# EAGLE schematic h7-disco (EAGLE 7.7.0)
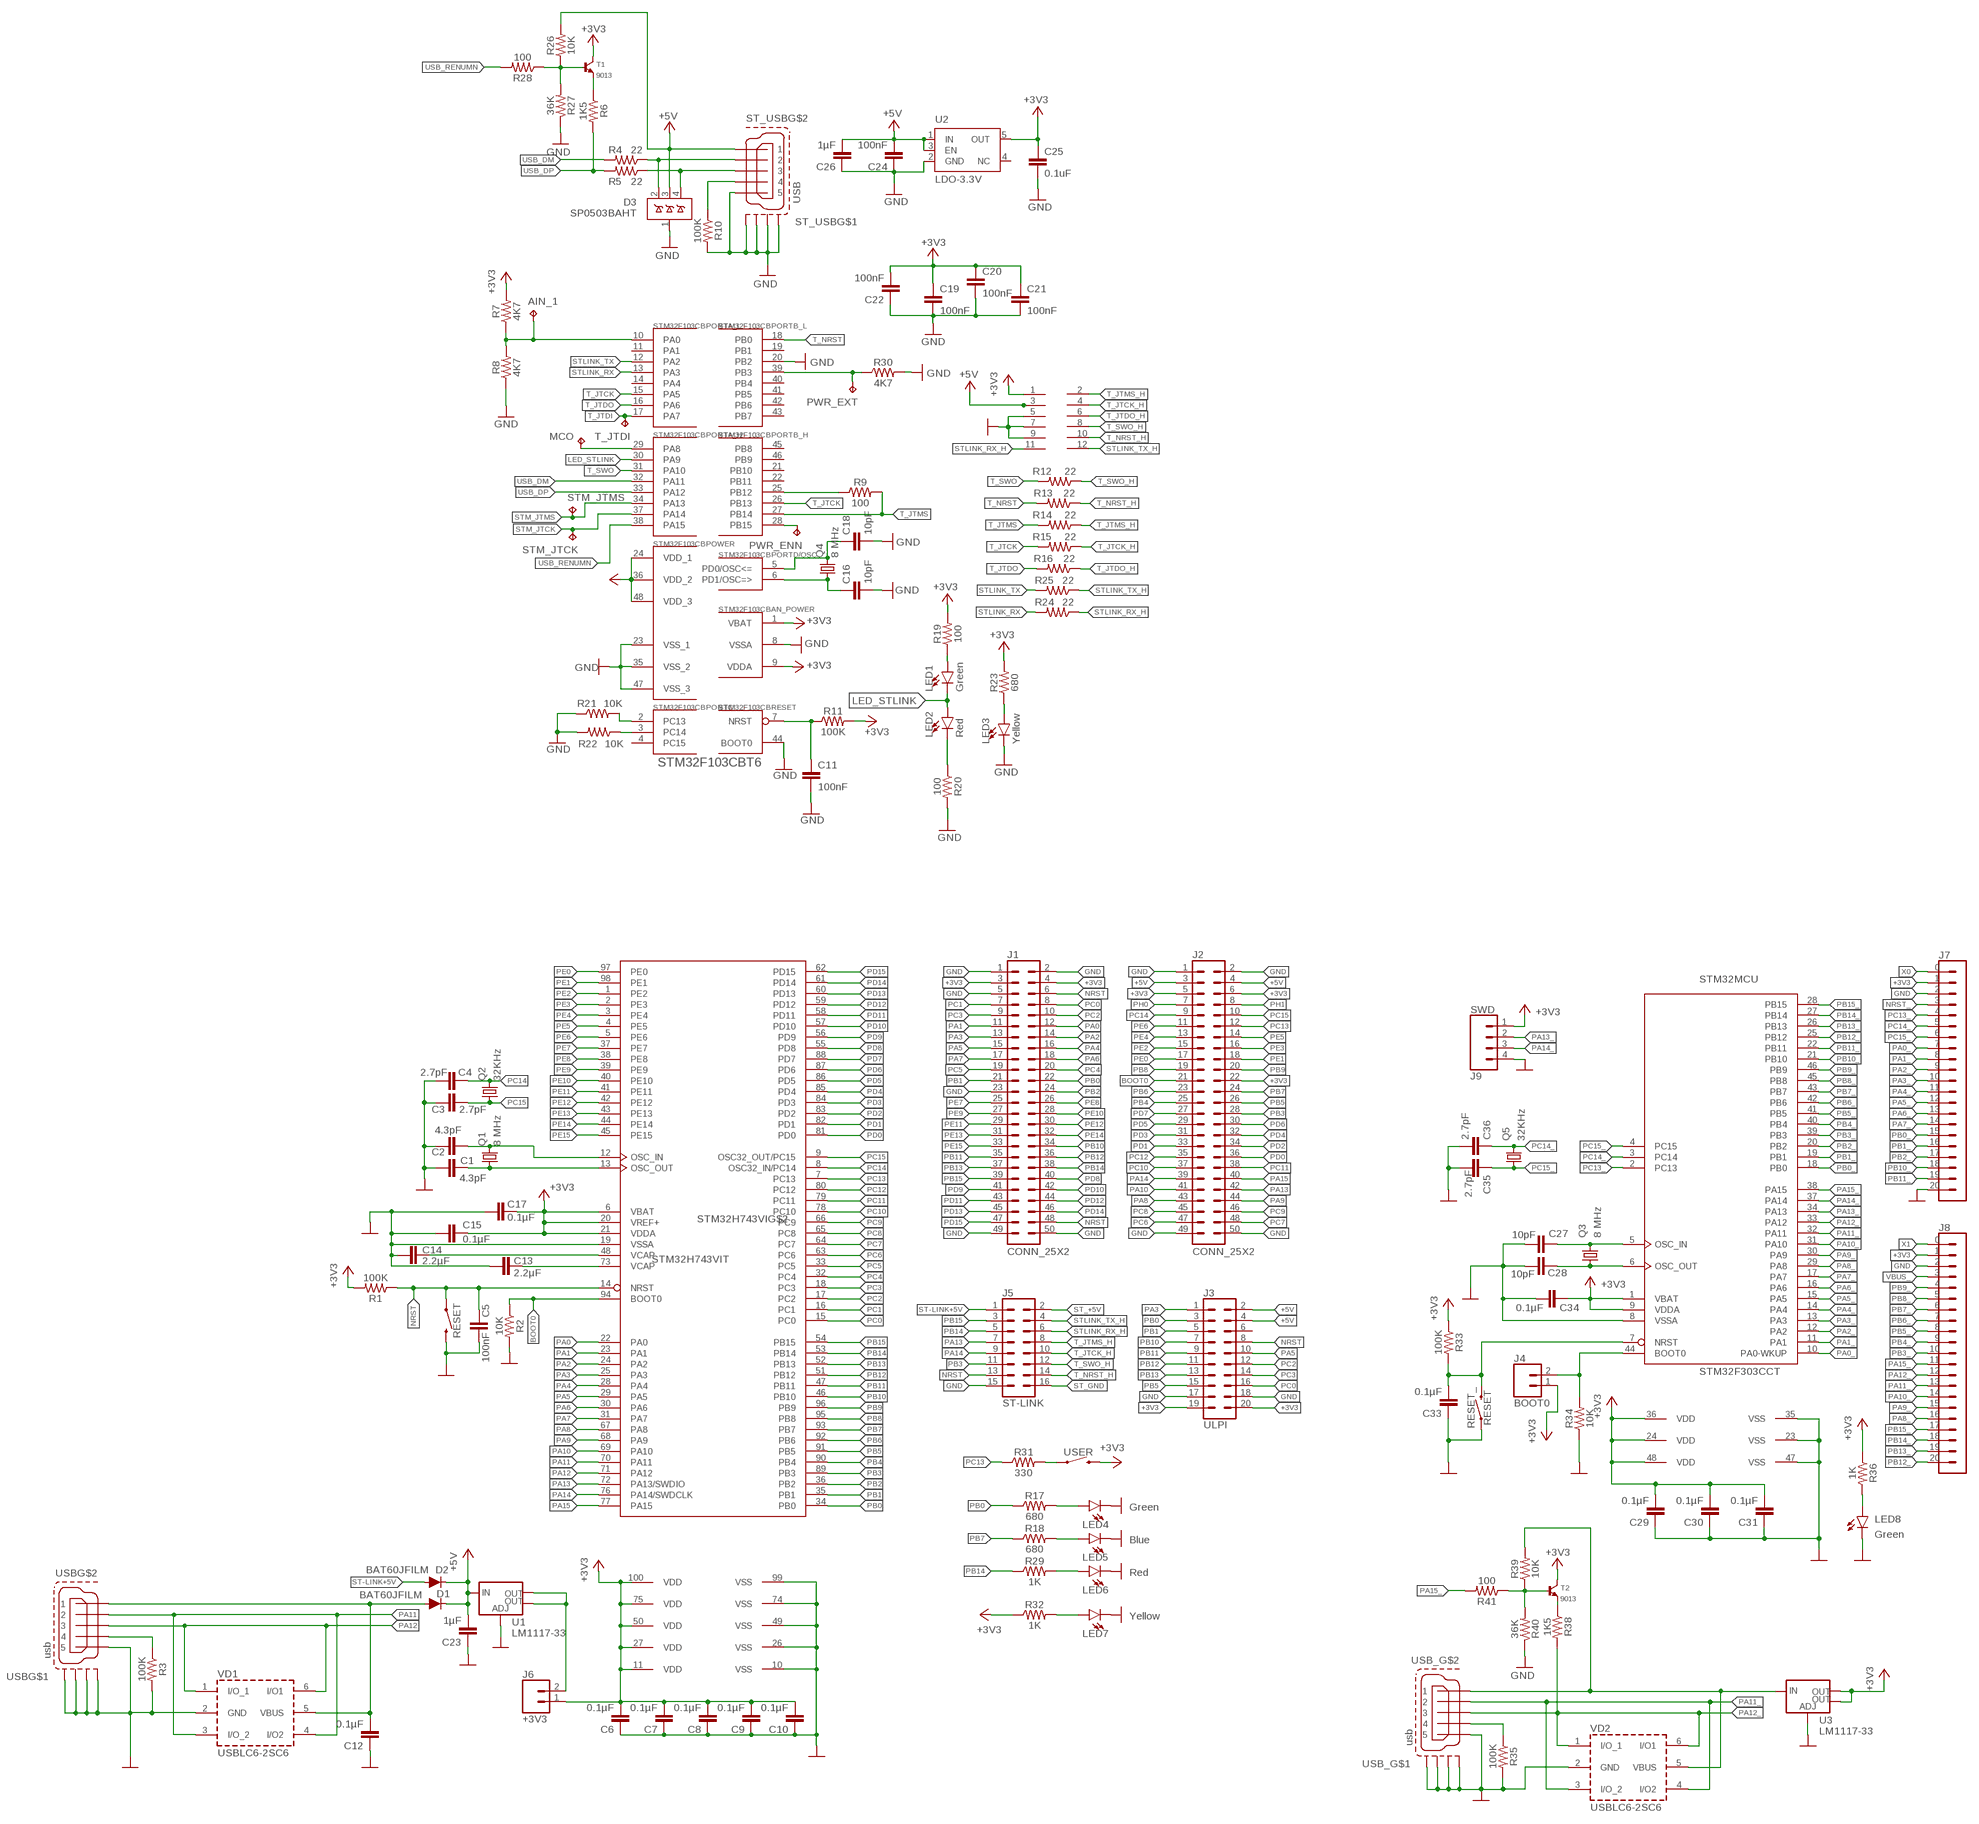
[diagram p0: schematic, sheet 1]

## Parts
AIN_1  TPTP10R  [TP10R]
C1  4.3pF  0.33UF/330NF-0805-50V-10%  [0805]
C2  4.3pF  0.33UF/330NF-0805-50V-10%  [0805]
C3  2.7pF  0.33UF/330NF-0805-50V-10%  [0805]
C4  2.7pF  0.33UF/330NF-0805-50V-10%  [0805]
C5  100nF  0.33UF/330NF-0805-50V-10%  [0805]
C6  0.1µF  0.33UF/330NF-0805-50V-10%  [0805]
C7  0.1µF  0.33UF/330NF-0805-50V-10%  [0805]
C8  0.1µF  0.33UF/330NF-0805-50V-10%  [0805]
C9  0.1µF  0.33UF/330NF-0805-50V-10%  [0805]
C10  0.1µF  0.33UF/330NF-0805-50V-10%  [0805]
C11  100nF  2.2UF-0805-25V-(+80/-20%)  [0805]
C12  0.1µF  0.33UF/330NF-0805-50V-10%  [0805]
C13  2.2µF  0.33UF/330NF-0805-50V-10%  [0805]
C14  2.2µF  0.33UF/330NF-0805-50V-10%  [0805]
C15  0.1µF  0.33UF/330NF-0805-50V-10%  [0805]
C16  10pF  2.2UF-0805-25V-(+80/-20%)  [0805]
C17  0.1µF  0.33UF/330NF-0805-50V-10%  [0805]
C18  10pF  2.2UF-0805-25V-(+80/-20%)  [0805]
C19  100nF  2.2UF-0805-25V-(+80/-20%)  [0805]
C20  100nF  2.2UF-0805-25V-(+80/-20%)  [0805]
C21  100nF  2.2UF-0805-25V-(+80/-20%)  [0805]
C22  100nF  2.2UF-0805-25V-(+80/-20%)  [0805]
C23  1µF  2.2UF-1206-50V-10%  [1206]
C24  100nF  0.33UF/330NF-0805-50V-10%  [0805]
C25  0.1uF  2.2UF-0805-25V-(+80/-20%)  [0805]
C26  1µF  2.2UF-1206-50V-10%  [1206]
C27  10pF  0.33UF/330NF-0805-50V-10%  [0805]
C28  10pF  0.33UF/330NF-0805-50V-10%  [0805]
C29  0.1µF  0.33UF/330NF-0805-50V-10%  [0805]
C30  0.1µF  0.33UF/330NF-0805-50V-10%  [0805]
C31  0.1µF  0.33UF/330NF-0805-50V-10%  [0805]
C33  0.1µF  0.33UF/330NF-0805-50V-10%  [0805]
C34  0.1µF  0.33UF/330NF-0805-50V-10%  [0805]
C35  2.7pF  0.33UF/330NF-0805-50V-10%  [0805]
C36  2.7pF  0.33UF/330NF-0805-50V-10%  [0805]
CN2  M06X2  [PLANAR-6X2]
D1  BAT60JFILM  DIODE-BAS16J  [SOD-323]
D2  BAT60JFILM  DIODE-BAS16J  [SOD-323]
D3  SP0503BAHT  [SOT143]
J1  CONN_25X2  [2X25]
J2  CONN_25X2  [2X25]
J3  ULPI  CONN_10X2MIRR  [2X10-MIRROR]
J4  BOOT0  CONN_02  [1X02]
J5  ST-LINK  CONN_08X2  [2X8]
J6  +3V3  CONN_02  [1X02]
J7  CONN_21  [1X21]
J8  CONN_21  [1X21]
J9  SWD  CONN_04  [1X04]
LED1  Green  LED  [LED-0805]
LED2  Red  LED  [LED-0805]
LED3  Yellow  LED  [LED-0805]
LED4  Green  LED  [LED-0805]
LED5  Blue  LED  [LED-0805]
LED6  Red  LED  [LED-0805]
LED7  Yellow  LED  [LED-0805]
LED8  Green  LED  [LED-0805]
MCO  TPTP10R  [TP10R]
PWR_ENN  TPTP10R  [TP10R]
PWR_EXT  TPTP10R  [TP10R]
Q1  8 MHz  CRYSTALHC49S  [HC49/S]
Q2  32KHz  CRYSTALTC26H  [TC26H]
Q3  8 MHz  CRYSTALHC49S  [HC49/S]
Q4  8 MHz  CRYSTALHC49S  [HC49/S]
Q5  32KHz  CRYSTALTC26H  [TC26H]
R1  100K  RESISTOR0805  [0805]
R2  10K  RESISTOR0805  [0805]
R3  100K  RESISTOR0805  [0805]
R4  22  RESISTOR0805  [0805]
R5  22  RESISTOR0805  [0805]
R6  1K5  RESISTOR0805  [0805]
R7  4K7  RESISTOR0805  [0805]
R8  4K7  RESISTOR0805  [0805]
R9  100  RESISTOR0805  [0805]
R10  100K  RESISTOR0805  [0805]
R11  100K  RESISTOR0805  [0805]
R12  22  RESISTOR0805  [0805]
R13  22  RESISTOR0805  [0805]
R14  22  RESISTOR0805  [0805]
R15  22  RESISTOR0805  [0805]
R16  22  RESISTOR0805  [0805]
R17  680  RESISTOR0805  [0805]
R18  680  RESISTOR0805  [0805]
R19  100  RESISTOR0805  [0805]
R20  100  RESISTOR0805  [0805]
R21  10K  RESISTOR0805  [0805]
R22  10K  RESISTOR0805  [0805]
R23  680  RESISTOR0805  [0805]
R24  22  RESISTOR0805  [0805]
R25  22  RESISTOR0805  [0805]
R26  10K  RESISTOR0805  [0805]
R27  36K  RESISTOR0805  [0805]
R28  100  RESISTOR0805  [0805]
R29  1K  RESISTOR0805  [0805]
R30  4K7  RESISTOR0805  [0805]
R31  330  RESISTOR0805  [0805]
R32  1K  RESISTOR0805  [0805]
R33  100K  RESISTOR0805  [0805]
R34  10K  RESISTOR0805  [0805]
R35  100K  RESISTOR0805  [0805]
R36  1K  RESISTOR0805  [0805]
R38  1K5  RESISTOR0805  [0805]
R39  10K  RESISTOR0805  [0805]
R40  36K  RESISTOR0805  [0805]
R41  100  RESISTOR0805  [0805]
RESET  MOMENTARY-SWITCH-SPST-SMD-6.2MM-TALL  [TACTILE_SWITCH_SMD_6.2MM_TALL]
RESET_  RESET  MOMENTARY-SWITCH-SPST-SMD-6.0X3.5MM  [TACTILE_SWITCH_SMD_6.0X3.5MM]
ST_USB  USB  MICRO-USB-SHIELD-MICRO_USB-B_4.85_HORN  [MICRO_USB-B_4.85_HORN]
STM32  STM32F303CCT  [LQFP48]
STM32F103CB  STM32F103CBT6  STM32F10XCXT6  [TQFP48]
STM32H743VI  STM32H743VIT  [LQFP100]
STM_JTCK  TPTP10R  [TP10R]
STM_JTMS  TPTP10R  [TP10R]
T1  9013  NPNBC847  [SOT-23]
T2  9013  NPNBC847  [SOT-23]
T_JTDI  TPTP10R  [TP10R]
U1  LM1117-33  V_REG_LM1117SOT223  [SOT223]
U2  LDO-3.3V  TPS73033  [SOT23-5]
U3  LM1117-33  V_REG_LM1117SOT223  [SOT223]
USB  usb  MICRO-USB-SHIELD-MICRO_USB-B_4.85_HORN  [MICRO_USB-B_4.85_HORN]
USB_  usb  MICRO-USB-SHIELD-MICRO_USB-B_4.85_HORN  [MICRO_USB-B_4.85_HORN]
USER  MOMENTARY-SWITCH-SPST-SMD-6.2MM-TALL  [TACTILE_SWITCH_SMD_6.2MM_TALL]
VD1  USBLC6-2SC6  [SOT-23-6L]
VD2  USBLC6-2SC6  [SOT-23-6L]

## Nets
+3V3: C6.2 C7.2 C8.2 C9.2 C10.2 C15.1 C17.1 C29.2 C30.2 C31.2 C34.1 J1.3 J1.4 J2.5 J2.6 J2.22 J3.19 J3.20 J4.1 J6.1 J7.1 J8.1 J9.1 R1.2 R32.1 R33.1 R36.1 STM32.1(MCU:VBAT) STM32.9(MCU:VDDA) STM32.24(PWR:VDD) STM32.36(PWR:VDD) STM32.48(PWR:VDD) STM32H743VI.6(VBAT) STM32H743VI.11(VDD) STM32H743VI.20(VREF+) STM32H743VI.21(VDDA) STM32H743VI.27(VDD) STM32H743VI.50(VDD) STM32H743VI.75(VDD) STM32H743VI.100(VDD) T2.3(C) U3.2(OUT) U3.4(OUT) USER.B2
+5V: C23.2 D1.C D2.C J2.3 J2.4 J3.2 J3.4 U1.3(IN)
AIN_1: AIN_1.TP R7.1 R8.2 STM32F103CB.10(PORTA_L:PA0)
BOOT0: J2.21 R2.1 STM32H743VI.94(BOOT0)
BOOT0_: J4.2 R34.2 STM32.44(MCU:BOOT0)
D+1: D3.4(D3) R5.1 ST_USB.3
D-1: D3.2(D1) R4.1 ST_USB.2
GND: C1.1 C2.1 C3.1 C4.1 C5.1 C6.1 C7.1 C8.1 C9.1 C10.1 C12.1 C13.2 C14.2 C15.2 C17.2 C23.1 C27.1 C28.2 C29.1 C30.1 C31.1 C33.1 C34.2 C35.1 C36.1 J1.1 J1.2 J1.5 J1.23 J1.49 J1.50 J2.1 J2.2 J2.49 J2.50 J3.17 J3.18 J5.15 J7.2 J7.20 J8.2 J9.4 LED4.C LED5.C LED6.C LED7.C LED8.C R2.2 R3.2 R34.1 R35.2 R40.1 RESET.B2 RESET_.1 STM32.8(MCU:VSSA) STM32.23(PWR:VSS) STM32.35(PWR:VSS) STM32.47(PWR:VSS) STM32H743VI.10(VSS) STM32H743VI.19(VSSA) STM32H743VI.26(VSS) STM32H743VI.49(VSS) STM32H743VI.74(VSS) STM32H743VI.99(VSS) U1.1(ADJ) U3.1(ADJ) USB.5 USB.M1(S1) USB.M2(S2) USB.M3(S3) USB.M4(S4) USB_.5 USB_.M1(S1) USB_.M2(S2) USB_.M3(S3) USB_.M4(S4) VD1.2(GND) VD2.2(GND)
ID: R3.1 USB.4
ID_: R35.1 USB_.4
LED_STLINK: LED1.C LED2.A STM32F103CB.30(PORTA_H:PA9)
MCO: MCO.TP STM32F103CB.29(PORTA_H:PA8)
N$1: C1.2 Q1.1 STM32H743VI.13(OSC_OUT)
N$2: C2.2 Q1.2 STM32H743VI.12(OSC_IN)
N$3: C11.1 R11.1 STM32F103CB.7(RESET:NRST)
N$4: C18.1 Q4.2 STM32F103CB.5(PORTD/OSC:PD0/OSC<=)
N$5: C16.1 Q4.1 STM32F103CB.6(PORTD/OSC:PD1/OSC=>)
N$6: R26.1 R27.2 R28.1 T1.1(B)
N$7: LED2.C R20.1
N$8: LED1.A R19.1
N$10: LED5.A R18.2
N$11: J6.2 U1.2(OUT) U1.4(OUT)
N$12: LED3.A R23.1
N$13: R6.1 T1.2(E)
N$14: LED4.A R17.2
N$15: R21.2 STM32F103CB.2(PORTC:PC13)
N$16: R22.1 STM32F103CB.3(PORTC:PC14)
N$17: LED7.A R32.2
N$19: R10.1 ST_USB.4
N$20: R38.1 T2.2(E)
N$21: R39.1 R40.2 R41.1 T2.1(B)
N$22: LED6.A R29.2
N$23: R31.2 USER.A2
N$24: LED8.A R36.2
NRST: C5.2 J1.6 J1.48 J3.8 J5.13 R1.1 RESET.A2 STM32H743VI.14(NRST)
NRST_: C33.2 J7.3 R33.2 RESET_.2 STM32.7(MCU:NRST)
PA0: J1.12 STM32H743VI.22(PA0)
PA0_: J7.7 STM32.10(MCU:PA0-WKUP)
PA1: J1.11 STM32H743VI.23(PA1)
PA1_: J7.8 STM32.11(MCU:PA1)
PA2: J1.14 STM32H743VI.24(PA2)
PA2_: J7.9 STM32.12(MCU:PA2)
PA3: J1.13 J3.1 STM32H743VI.25(PA3)
PA3_: J7.10 STM32.13(MCU:PA3)
PA4: J1.16 STM32H743VI.28(PA4)
PA4_: J7.11 STM32.14(MCU:PA4)
PA5: J1.15 J3.10 STM32H743VI.29(PA5)
PA5_: J7.12 STM32.15(MCU:PA5)
PA6: J1.18 STM32H743VI.30(PA6)
PA6_: J7.13 STM32.16(MCU:PA6)
PA7: J1.17 STM32H743VI.31(PA7)
PA7_: J7.14 STM32.17(MCU:PA7)
PA8: J2.43 STM32H743VI.67(PA8)
PA8_: J8.16 STM32.29(MCU:PA8)
PA9: J2.44 STM32H743VI.68(PA9)
PA9_: J8.15 STM32.30(MCU:PA9)
PA10: J2.41 STM32H743VI.69(PA10)
PA10_: J8.14 STM32.31(MCU:PA10)
PA11: STM32H743VI.70(PA11) USB.2 VD1.3(I/O_2) VD1.4(I/O2)
PA11_: J8.13 STM32.32(MCU:PA11) USB_.2 VD2.3(I/O_2) VD2.4(I/O2)
PA12: STM32H743VI.71(PA12) USB.3 VD1.1(I/O_1) VD1.6(I/O1)
PA12_: J8.12 R38.2 STM32.33(MCU:PA12) USB_.3 VD2.1(I/O_1) VD2.6(I/O1)
PA13: J2.42 J5.7 STM32H743VI.72(PA13/SWDIO)
PA13_: J9.2 STM32.34(MCU:PA13)
PA14: J2.39 J5.9 STM32H743VI.76(PA14/SWDCLK)
PA14_: J9.3 STM32.37(MCU:PA14)
PA15: J2.40 STM32H743VI.77(PA15)
PA15_: J8.11 R41.2 STM32.38(MCU:PA15)
PB0: J1.22 J3.3 R17.1 STM32H743VI.34(PB0)
PB0_: J7.15 STM32.18(MCU:PB0)
PB1: J1.21 J3.5 STM32H743VI.35(PB1)
PB1_: J7.16 STM32.19(MCU:PB1)
PB2: J1.24 STM32H743VI.36(PB2)
PB2_: J7.17 STM32.20(MCU:PB2)
PB3: J2.28 J5.11 STM32H743VI.89(PB3)
PB3_: J8.10 STM32.39(MCU:PB3)
PB4: J2.25 STM32H743VI.90(PB4)
PB4_: J8.9 STM32.40(MCU:PB4)
PB5: J2.26 J3.15 STM32H743VI.91(PB5)
PB5_: J8.8 STM32.41(MCU:PB5)
PB6: J2.23 STM32H743VI.92(PB6)
PB6_: J8.7 STM32.42(MCU:PB6)
PB7: J2.24 R18.1 STM32H743VI.93(PB7)
PB7_: J8.6 STM32.43(MCU:PB7)
PB8: J2.19 STM32H743VI.95(PB8)
PB8_: J8.5 STM32.45(MCU:PB8)
PB9: J2.20 STM32H743VI.96(PB9)
PB9_: J8.4 STM32.46(MCU:PB9)
PB10: J1.34 J3.7 STM32H743VI.46(PB10)
PB10_: J7.18 STM32.21(MCU:PB10)
PB11: J1.35 J3.9 STM32H743VI.47(PB11)
PB11_: J7.19 STM32.22(MCU:PB11)
PB12: J1.36 J3.11 STM32H743VI.51(PB12)
PB12_: J8.20 STM32.25(MCU:PB12)
PB13: J1.37 J3.13 STM32H743VI.52(PB13)
PB13_: J8.19 STM32.26(MCU:PB13)
PB14: J1.38 J5.5 R29.1 STM32H743VI.53(PB14)
PB14_: J8.18 STM32.27(MCU:PB14)
PB15: J1.39 J5.3 STM32H743VI.54(PB15)
PB15_: J8.17 STM32.28(MCU:PB15)
PB16: PWR_ENN.TP STM32F103CB.28(PORTB_H:PB15)
PC0: J1.8 J3.16 STM32H743VI.15(PC0)
PC1: J1.7 STM32H743VI.16(PC1)
PC2: J1.10 J3.12 STM32H743VI.17(PC2)
PC3: J1.9 J3.14 STM32H743VI.18(PC3)
PC4: J1.20 STM32H743VI.32(PC4)
PC5: J1.19 STM32H743VI.33(PC5)
PC6: J2.47 STM32H743VI.63(PC6)
PC7: J2.48 STM32H743VI.64(PC7)
PC8: J2.45 STM32H743VI.65(PC8)
PC9: J2.46 STM32H743VI.66(PC9)
PC10: J2.37 STM32H743VI.78(PC10)
PC11: J2.38 STM32H743VI.79(PC11)
PC12: J2.35 STM32H743VI.80(PC12)
PC13: J2.12 R31.1 STM32H743VI.7(PC13)
PC13_: J7.4 STM32.2(MCU:PC13)
PC14: C4.2 J2.9 Q2.2 STM32H743VI.8(OSC32_IN/PC14)
PC14_: C36.2 J7.5 Q5.2 STM32.3(MCU:PC14)
PC15: C3.2 J2.10 Q2.1 STM32H743VI.9(OSC32_OUT/PC15)
PC15_: C35.2 J7.6 Q5.1 STM32.4(MCU:PC15)
PD0: J2.36 STM32H743VI.81(PD0)
PD1: J2.33 STM32H743VI.82(PD1)
PD2: J2.34 STM32H743VI.83(PD2)
PD3: J2.31 STM32H743VI.84(PD3)
PD4: J2.32 STM32H743VI.85(PD4)
PD5: J2.29 STM32H743VI.86(PD5)
PD6: J2.30 STM32H743VI.87(PD6)
PD7: J2.27 STM32H743VI.88(PD7)
PD8: J1.40 STM32H743VI.55(PD8)
PD9: J1.41 STM32H743VI.56(PD9)
PD10: J1.42 STM32H743VI.57(PD10)
PD11: J1.43 STM32H743VI.58(PD11)
PD12: J1.44 STM32H743VI.59(PD12)
PD13: J1.45 STM32H743VI.60(PD13)
PD14: J1.46 STM32H743VI.61(PD14)
PD15: J1.47 STM32H743VI.62(PD15)
PE0: J2.17 STM32H743VI.97(PE0)
PE1: J2.18 STM32H743VI.98(PE1)
PE2: J2.15 STM32H743VI.1(PE2)
PE3: J2.16 STM32H743VI.2(PE3)
PE4: J2.13 STM32H743VI.3(PE4)
PE5: J2.14 STM32H743VI.4(PE5)
PE6: J2.11 STM32H743VI.5(PE6)
PE7: J1.25 STM32H743VI.37(PE7)
PE8: J1.26 STM32H743VI.38(PE8)
PE9: J1.27 STM32H743VI.39(PE9)
PE10: J1.28 STM32H743VI.40(PE10)
PE11: J1.29 STM32H743VI.41(PE11)
PE12: J1.30 STM32H743VI.42(PE12)
PE13: J1.31 STM32H743VI.43(PE13)
PE14: J1.32 STM32H743VI.44(PE14)
PE15: J1.33 STM32H743VI.45(PE15)
PF0_: C27.2 Q3.2 STM32.5(MCU:OSC_IN)
PF1_: C28.1 Q3.1 STM32.6(MCU:OSC_OUT)
PH0: J2.7
PH1: J2.8
PWR_EXT: PWR_EXT.TP R30.1 STM32F103CB.39(PORTB_L:PB3)
ST-LINK+5V: D2.A J5.1
ST_+3V3: C19.1 C20.1 C21.1 C22.2 C25.1 CN2.1 R7.2 R11.2 R19.2 R23.2 STM32F103CB.1(AN_POWER:VBAT) STM32F103CB.9(AN_POWER:VDDA) STM32F103CB.24(POWER:VDD_1) STM32F103CB.36(POWER:VDD_2) STM32F103CB.48(POWER:VDD_3) T1.3(C) U2.5(OUT) ; supply symbol labelled +3V3
ST_+5V: C24.2 C26.2 CN2.3 D3.3(D2) J5.2 R26.2 ST_USB.1 U2.1(IN) U2.3(EN) ; supply symbol labelled +5V
ST_GND: C11.2 C16.2 C18.2 C19.2 C20.2 C21.2 C22.1 C24.1 C25.2 C26.1 CN2.5 CN2.7 CN2.9 D3.1(GND) J5.16 LED3.C R8.1 R10.2 R20.2 R21.1 R22.2 R27.1 R30.2 ST_USB.5 ST_USB.M1(S1) ST_USB.M2(S2) ST_USB.M3(S3) ST_USB.M4(S4) STM32F103CB.8(AN_POWER:VSSA) STM32F103CB.20(PORTB_L:PB2) STM32F103CB.23(POWER:VSS_1) STM32F103CB.35(POWER:VSS_2) STM32F103CB.44(RESET:BOOT0) STM32F103CB.47(POWER:VSS_3) U2.2(GND) ; supply symbol labelled GND
STLINK_RX: R24.2 STM32F103CB.13(PORTA_L:PA3)
STLINK_RX_H: CN2.11 J5.6 R24.1
STLINK_TX: R25.2 STM32F103CB.12(PORTA_L:PA2)
STLINK_TX_H: CN2.12 J5.4 R25.1
STM_JTCK: STM32F103CB.37(PORTA_H:PA14) STM_JTCK.TP
STM_JTMS: STM32F103CB.34(PORTA_H:PA13) STM_JTMS.TP
T_JTCK: R15.2 STM32F103CB.15(PORTA_L:PA5) STM32F103CB.26(PORTB_H:PB13)
T_JTCK_H: CN2.4 J5.10 R15.1
T_JTDI: STM32F103CB.17(PORTA_L:PA7) T_JTDI.TP
T_JTDO: R16.2 STM32F103CB.16(PORTA_L:PA6)
T_JTDO_H: CN2.6 R16.1
T_JTMS: R9.2 R14.2 STM32F103CB.27(PORTB_H:PB14)
T_JTMS_H: CN2.2 J5.8 R14.1
T_NRST: R13.2 STM32F103CB.18(PORTB_L:PB0)
T_NRST_H: CN2.10 J5.14 R13.1
T_SWDIO_IN: R9.1 STM32F103CB.25(PORTB_H:PB12)
T_SWO: R12.2 STM32F103CB.31(PORTA_H:PA10)
T_SWO_H: CN2.8 J5.12 R12.1
USB_DM: R4.2 STM32F103CB.32(PORTA_H:PA11)
USB_DP: R5.2 R6.2 STM32F103CB.33(PORTA_H:PA12)
USB_RENUMN: R28.2 STM32F103CB.38(PORTA_H:PA15)
VBUS: C12.2 D1.A USB.1 VD1.5(VBUS)
VBUS_: J8.3 R39.2 U3.3(IN) USB_.1 VD2.5(VBUS)
VCAP1: C14.1 STM32H743VI.48(VCAP)
VCAP2: C13.1 STM32H743VI.73(VCAP)
X0: J7.0
X1: J8.0
Unconnected: J3.6 STM32F103CB.4(PORTC:PC15) STM32F103CB.11(PORTA_L:PA1) STM32F103CB.14(PORTA_L:PA4) STM32F103CB.19(PORTB_L:PB1) STM32F103CB.21(PORTB_H:PB10) STM32F103CB.22(PORTB_H:PB11) STM32F103CB.40(PORTB_L:PB4) STM32F103CB.41(PORTB_L:PB5) STM32F103CB.42(PORTB_L:PB6) STM32F103CB.43(PORTB_L:PB7) STM32F103CB.45(PORTB_H:PB8) STM32F103CB.46(PORTB_H:PB9) U2.4(NC)

## Library data of the parts
AIN_1 MCO PWR_ENN PWR_EXT STM_JTCK STM_JTMS T_JTDI = testpad:TP: Test pad
C1-C10 C12-C15 C17 C24 C27-C31 C33-C36 = SparkFun-Capacitors:0.33UF/330NF: 0.33µF/330nF ceramic capacitors A capacitor is a passive two-terminal electrical component used to store electrical energy temporarily in an electric field.; PROD_ID: CAP-08469; VALUE: 0.33µF
C11 C16 C18-C22 C25 = SparkFun-Capacitors:2.2UF: 2.2µF ceramic capacitors A capacitor is a passive two-terminal electrical component used to store electrical energy temporarily in an electric field.; PROD_ID: CAP-11624; VALUE: 2.2uF
C23 C26 = SparkFun-Capacitors:2.2UF: 2.2µF ceramic capacitors A capacitor is a passive two-terminal electrical component used to store electrical energy temporarily in an electric field.; PROD_ID: CAP-10009; VALUE: 2.2uF
CN2 = X893:M06X2
D1 D2 = SparkFun-DiscreteSemi:DIODE: Diode These are standard reverse protection diodes and small signal diodes. SparkFun Products: SparkFun SparkPunk Sound Kit <https://www.sparkfun.com/products/11177> SparkFun ESP8266 Thing <https://www.sparkfun.com/products/13231>; PROD_ID: DIO-09646; VALUE: 250mA/100V
D3 = X893:SP0503BAHT: Surface Mount TVS Avalanche Diode Array (5V) http://www.littelfuse.com/data/en/Data_Sheets/SP05xxBA.pdf
J1 J2 = SparkFun-Connectors:CONN_25X2: Multi connection point. Often used as Generic Header-pin footprint for 0.1 inch spaced/style header connections On any of the 0.1 inch spaced packages, you can populate with these: Break Away Headers - Straight <https://www.sparkfun.com/products/116> (PRT-00116) Break Away Male Headers - Right Angle <https://www.sparkfun.com/products/553> (PRT-00553) Female Headers <https://www.sparkfun.com/products/115> (PRT-00115) Break Away Headers - Machine Pin <https://www.sparkfun.com/products/117> (PRT-00117) Break Away Female Headers - Swiss Machine Pin <https://www.sparkfun.com/products/743> (PRT-00743)
J3 = SparkFun-Connectors:CONN_10X2: Multi connection point. Often used as Generic Header-pin footprint for 0.1 inch spaced/style header connections On any of the 0.1 inch spaced packages, you can populate with these: Break Away Headers - Straight <https://www.sparkfun.com/products/116> (PRT-00116) Break Away Male Headers - Right Angle <https://www.sparkfun.com/products/553> (PRT-00553) Female Headers <https://www.sparkfun.com/products/115> (PRT-00115) Break Away Headers - Machine Pin <https://www.sparkfun.com/products/117> (PRT-00117) Break Away Female Headers - Swiss Machine Pin <https://www.sparkfun.com/products/743> (PRT-00743) Special note about the "SPECIAL" package: This was SPECIALLY designed to be used with our Graphic LCD Backpack. Be sure you want to use this! It is not only staggered on each line of header holes, but IT IS ALSO offset of the center point of the top and bottom lines by 5 mil. This causes the headers to lock into place on the "standard" footprint on the LCD screen. The extra squares on the tdocu layer are there simply to reference other pins (if you were to actually populate a longer header than ten long - this is what we do with the backpacks).
J4 J6 = SparkFun-Connectors:CONN_02: Multi connection point. Often used as Generic Header-pin footprint for 0.1 inch spaced/style header connections On any of the 0.1 inch spaced packages, you can populate with these: Break Away Headers - Straight <https://www.sparkfun.com/products/116> (PRT-00116) Break Away Male Headers - Right Angle <https://www.sparkfun.com/products/553> (PRT-00553) Female Headers <https://www.sparkfun.com/products/115> (PRT-00115) Break Away Headers - Machine Pin <https://www.sparkfun.com/products/117> (PRT-00117) Break Away Female Headers - Swiss Machine Pin <https://www.sparkfun.com/products/743> (PRT-00743) For SCREWTERMINALS and SPRING TERMINALS visit here: Screw Terimnals on SparkFun.com <https://www.sparkfun.com/search/results?term=Screw+Terminals> (5mm/3.5mm/2.54mm spacing) This device is also useful as a general connection point to wire up your design to another part of your project. Our various solder wires solder well into these plated through hole pads. Hook-Up Wire - Assortment (Stranded, 22 AWG) <https://www.sparkfun.com/products/11375> (PRT-11375) Hook-Up Wire - Assortment (Solid Core, 22 AWG) <https://www.sparkfun.com/products/11367> (PRT-11367) View the entire wire category on our website here <https://www.sparkfun.com/categories/141> Special notes: Molex polarized connector foot print use with: PRT-08233 with associated crimp pins and housings. 2.54_SCREWTERM for use with PRT-10571. 3.5mm Screw Terminal footprints for PRT-08084 5mm Screw Terminal footprints for use with PRT-08432
J5 = SparkFun-Connectors:CONN_08X2: Multi connection point. Often used as Generic Header-pin footprint for 0.1 inch spaced/style header connections You can populate with any combo of single row headers, but if you'd like an exact match, check this: Header - 2x8 (Male, 0.1") <https://www.sparkfun.com/products/13156> (PRT-13156) On any of the 0.1 inch spaced packages, you can populate with these: Break Away Headers - Straight <https://www.sparkfun.com/products/116> (PRT-00116) Break Away Male Headers - Right Angle <https://www.sparkfun.com/products/553> (PRT-00553) Female Headers <https://www.sparkfun.com/products/115> (PRT-00115) Break Away Headers - Machine Pin <https://www.sparkfun.com/products/117> (PRT-00117) Break Away Female Headers - Swiss Machine Pin <https://www.sparkfun.com/products/743> (PRT-00743)
J7 J8 = SparkFun-Connectors:CONN_21: Multi connection point. Often used as Generic Header-pin footprint for 0.1 inch spaced/style header connections On any of the 0.1 inch spaced packages, you can populate with these: Break Away Headers - Straight <https://www.sparkfun.com/products/116> (PRT-00116) Break Away Male Headers - Right Angle <https://www.sparkfun.com/products/553> (PRT-00553) Female Headers <https://www.sparkfun.com/products/115> (PRT-00115) Break Away Headers - Machine Pin <https://www.sparkfun.com/products/117> (PRT-00117) Break Away Female Headers - Swiss Machine Pin <https://www.sparkfun.com/products/743> (PRT-00743) For SCREWTERMINALS and SPRING TERMINALS visit here: Screw Terimnals on SparkFun.com <https://www.sparkfun.com/search/results?term=Screw+Terminals> (5mm/3.5mm/2.54mm spacing) This device is also useful as a general connection point to wire up your design to another part of your project. Our various solder wires solder well into these plated through hole pads. Hook-Up Wire - Assortment (Stranded, 22 AWG) <https://www.sparkfun.com/products/11375> (PRT-11375) Hook-Up Wire - Assortment (Solid Core, 22 AWG) <https://www.sparkfun.com/products/11367> (PRT-11367) View the entire wire category on our website here <https://www.sparkfun.com/categories/141> Special notes: Molex polarized connector foot print use with SKU : PRT-08231 with associated crimp pins and housings. 1MM SMD Version SKU: PRT-10208 NOTES ON THE VARIANTS LOCK and LOCK_LONGPADS... This footprint was designed to help hold the alignment of a through-hole component (i.e. 6-pin header) while soldering it into place. You may notice that each hole has been shifted either up or down by 0.005 of an inch from it's more standard position (which is a perfectly straight line). This slight alteration caused the pins (the squares in the middle) to touch the edges of the holes. Because they are alternating, it causes a "brace" to hold the component in place. 0.005 has proven to be the perfect amount of "off-center" position when using our standard breakaway headers. Although looks a little odd when you look at the bare footprint, once you have a header in there, the alteration is very hard to notice. Also,if you push a header all the way into place, it is covered up entirely on the bottom side.
J9 = SparkFun-Connectors:CONN_04: Multi connection point. Often used as Generic Header-pin footprint for 0.1 inch spaced/style header connections On any of the 0.1 inch spaced packages, you can populate with these: Break Away Headers - Straight <https://www.sparkfun.com/products/116> (PRT-00116) Break Away Male Headers - Right Angle <https://www.sparkfun.com/products/553> (PRT-00553) Female Headers <https://www.sparkfun.com/products/115> (PRT-00115) Break Away Headers - Machine Pin <https://www.sparkfun.com/products/117> (PRT-00117) Break Away Female Headers - Swiss Machine Pin <https://www.sparkfun.com/products/743> (PRT-00743) For SCREWTERMINALS and SPRING TERMINALS visit here: Screw Terimnals on SparkFun.com <https://www.sparkfun.com/search/results?term=Screw+Terminals> (5mm/3.5mm/2.54mm spacing) This device is also useful as a general connection point to wire up your design to another part of your project. Our various solder wires solder well into these plated through hole pads. Hook-Up Wire - Assortment (Stranded, 22 AWG) <https://www.sparkfun.com/products/11375> (PRT-11375) Hook-Up Wire - Assortment (Solid Core, 22 AWG) <https://www.sparkfun.com/products/11367> (PRT-11367) View the entire wire category on our website here <https://www.sparkfun.com/categories/141> Special notes: Molex polarized connector foot print use with SKU : PRT-08231 with associated crimp pins and housings. 1MM SMD Version SKU: PRT-10208; PROD_ID: CONN-09696
LED1-LED8 = SparkFun-LED:LED: LED (Generic) Standard schematic elements and footprints for 5mm, 3mm, 1206, and 0603 sized LEDs. Generic LEDs with no color specified.
Q1 Q3 Q4 = crystal:CRYSTAL: CRYSTAL; OC_FARNELL: 1667008; OC_NEWARK: unknown
Q2 Q5 = crystal:CRYSTAL: CRYSTAL; OC_FARNELL: unknown; OC_NEWARK: unknown
R1-R36 R38-R41 = SparkFun-Resistors:RESISTOR: Generic Resistor Package
RESET USER = SparkFun-Switches:MOMENTARY-SWITCH-SPST: Momentary Switch (Pushbutton) - SPST Normally-open (NO) SPST momentary switches (buttons, pushbuttons). Variants PTH-12MM - 12mm square, through-hole Momentary Pushbutton Switch - 12mm Square <https://www.sparkfun.com/products/9190> (COM-09190) PTH-6.0MM, PTH-6.0MM-KIT - 6.0mm square, through-hole Mini Pushbutton Switch <https://www.sparkfun.com/products/97> (COM-00097) KIT package intended for soldering kit's - only one side of pads' copper is exposed. PTH-RIGHT-ANGLE-KIT - Right-angle, through-hole Right Angle Tactile Button <https://www.sparkfun.com/products/10791> - Used on SparkFun BigTime Watch Kit <https://www.sparkfun.com/products/11734> SMD-12MM - 12mm square, surface-mount Tactile Button - SMD (12mm) <https://www.sparkfun.com/products/12993> (COM-12993) Used on SparkFun PicoBoard <https://www.sparkfun.com/products/11888> SMD-4.5MM - 4.5mm Square Trackball Switch Used on SparkFun Blackberry Trackballer Breakout <https://www.sparkfun.com/products/13169> SMD-4.6MMX2.8MM - 4.60mm x 2.80mm, surface mount Used on SparkFun SAMD21 Mini Breakout <https://www.sparkfun.com/products/13664> SMD-5.2MM, SMD-5.2-REDUNDANT - 5.2mm square, surface-mount Mini Pushbutton Switch - SMD <https://www.sparkfun.com/products/8720> (COM-08720) Used on Arduino Pro Mini <https://www.sparkfun.com/products/11114> REDUNDANT package connects both switch circuits together SMD-6.0X3.5MM - 6.0 x 3.5mm, surface mount Momentary Reset Switch SMD <https://www.sparkfun.com/products/8229> (COM-08229) SMD-6.2MM-TALL - 6.2mm square, surface mount Tactile Button - SMD (6mm) <https://www.sparkfun.com/products/12992> Used on SparkFun Digital Sandbox <https://www.sparkfun.com/products/12651> SMD-RIGHT-ANGLE - Right-angle, surface mount Used on SparkFun Block for Intel® Edison - Arduino <https://www.sparkfun.com/products/13036>; PROD_ID: SWCH-11966; SF_SKU: COM-12992
RESET_ = SparkFun-Switches:MOMENTARY-SWITCH-SPST: Momentary Switch (Pushbutton) - SPST Normally-open (NO) SPST momentary switches (buttons, pushbuttons). Variants PTH-12MM - 12mm square, through-hole Momentary Pushbutton Switch - 12mm Square <https://www.sparkfun.com/products/9190> (COM-09190) PTH-6.0MM, PTH-6.0MM-KIT - 6.0mm square, through-hole Mini Pushbutton Switch <https://www.sparkfun.com/products/97> (COM-00097) KIT package intended for soldering kit's - only one side of pads' copper is exposed. PTH-RIGHT-ANGLE-KIT - Right-angle, through-hole Right Angle Tactile Button <https://www.sparkfun.com/products/10791> - Used on SparkFun BigTime Watch Kit <https://www.sparkfun.com/products/11734> SMD-12MM - 12mm square, surface-mount Tactile Button - SMD (12mm) <https://www.sparkfun.com/products/12993> (COM-12993) Used on SparkFun PicoBoard <https://www.sparkfun.com/products/11888> SMD-4.5MM - 4.5mm Square Trackball Switch Used on SparkFun Blackberry Trackballer Breakout <https://www.sparkfun.com/products/13169> SMD-4.6MMX2.8MM - 4.60mm x 2.80mm, surface mount Used on SparkFun SAMD21 Mini Breakout <https://www.sparkfun.com/products/13664> SMD-5.2MM, SMD-5.2-REDUNDANT - 5.2mm square, surface-mount Mini Pushbutton Switch - SMD <https://www.sparkfun.com/products/8720> (COM-08720) Used on Arduino Pro Mini <https://www.sparkfun.com/products/11114> REDUNDANT package connects both switch circuits together SMD-6.0X3.5MM - 6.0 x 3.5mm, surface mount Momentary Reset Switch SMD <https://www.sparkfun.com/products/8229> (COM-08229) SMD-6.2MM-TALL - 6.2mm square, surface mount Tactile Button - SMD (6mm) <https://www.sparkfun.com/products/12992> Used on SparkFun Digital Sandbox <https://www.sparkfun.com/products/12651> SMD-RIGHT-ANGLE - Right-angle, surface mount Used on SparkFun Block for Intel® Edison - Arduino <https://www.sparkfun.com/products/13036>; PROD_ID: SWCH-00815; SF_SKU: COM-08229
ST_USB USB USB_ = con-hirose:MICRO-USB-SHIELD-: Hirose Micro USB Connector ZX62R-B-5P: Micro B, reverse (top mount) shell SMT Supplier: DigiKey H11574CT-ND Source: http://www.hirose.co.jp/cataloge_hp/e24200011.pdf
STM32 = micro-stm_v3:STM32F303C*T: ARM 32-bit Cortex™-M3 CPU 72 MHz maximum frequency 128 to 256 Kbytes of Flash memory 32 to 40 kbytes of SRAM 37 GPIOs 2.0 to 3.6 V application supply
STM32F103CB = stm32:STM32F10XCXT6: ST STM32F101/103 48pin LQFP
STM32H743VI = micro-stm_v3:STM32H7*3VIT: ARM 32-bit Cortex™-M7 CPU 400 MHz maximum frequency 2048 Kbytes of Flash memory 1024 kbytes of SRAM 82 GPIOs 1.71 to 3.6 V application supply; CRYPTO-HASH: no
T1 T2 = X893:NPN
U1 U3 = SparkFun-IC-Power:V_REG_LM1117: Voltage Regulator LM1117 Standard adjustable voltage regulator but in SMD form. Spark Fun Electronics SKU : COM-00595; PROD_ID: VREG-08170
U2 = X893:TPS73033: LOW-NOISE, HIGH PSRR, RF 200-mA LOW-DROPOUT LINEAR REGULATOR http://www.terraelectronica.ru/pdf/TI/TPS73033.pdf
VD1 VD2 = usblc6:USBLC6-2: VERY LOW CAPACITANCE ESD PROTECTION 2 line Datasheet link <http://www.st.com/web/catalog/sense_power/FM114/CL1137/SC1489/PF93353>